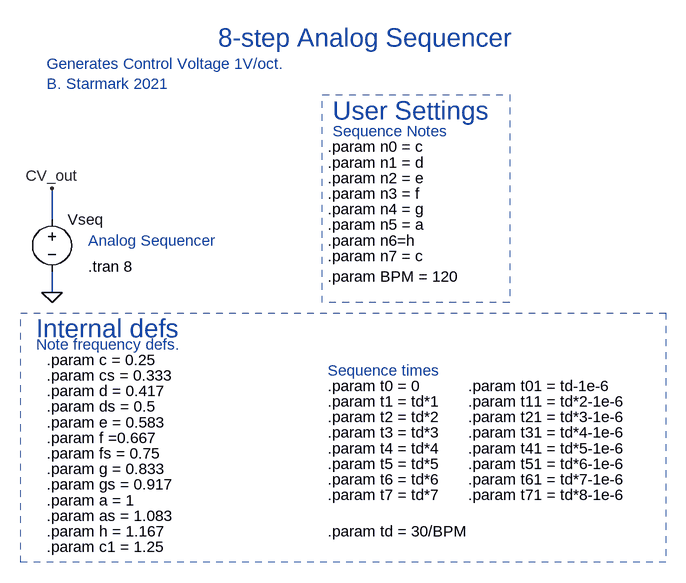
[diagram p0: schematic analog_sequencer_8.asc]
analog_sequencer_8.asc, the LTspice schematic file:
Version 4
SHEET 1 1448 1252
WIRE -576 0 -576 -48
WIRE -576 112 -576 80
FLAG -576 112 0
FLAG -576 -48 CV_out
SYMBOL voltage -576 -16 R0
WINDOW 3 28 110 Invisible 2
SYMATTR Value PWL REPEAT FOREVER ({t0} {n0} {t01} {n0} {t1} {n1} {t11} {n1} {t2} {n2} {t21} {n2} {t3} {n3} {t31} {n3} {t4} {n4} {t41} {n4} {t5} {n5} {t51} {n5} {t6} {n6} {t61} {n6} {t7} {n7} {t71} {n7}) ENDREPEAT
SYMATTR InstName Vseq
TEXT -520 72 Left 2 !.tran 8
TEXT -320 -280 Left 4 ;8-step Analog Sequencer
TEXT -584 -240 Left 2 ;Generates Control Voltage 1V/oct.\nB. Starmark 2021
TEXT -520 32 Left 2 ;Analog Sequencer
TEXT -152 -112 Left 2 !.param n0 = c
TEXT -152 -88 Left 2 !.param n1 = d
TEXT -152 -64 Left 2 !.param n2 = e
TEXT -152 -40 Left 2 !.param n3 = f
TEXT -152 -16 Left 2 !.param n4 = g
TEXT -152 8 Left 2 !.param n5 = a
TEXT -152 32 Left 2 !.param n6=h
TEXT -152 56 Left 2 !.param n7 = c
TEXT -600 192 Left 2 ;Note frequency defs.
TEXT -144 -136 Left 2 ;Sequence Notes
TEXT -152 88 Left 2 !.param BPM = 120
TEXT -152 232 Left 2 ;Sequence times
TEXT -152 256 Left 2 !.param t0 = 0
TEXT 64 256 Left 2 !.param t01 = td-1e-6
TEXT -152 480 Left 2 !.param td = 30/BPM
TEXT -152 280 Left 2 !.param t1 = td*1
TEXT 64 280 Left 2 !.param t11 = td*2-1e-6
TEXT -152 304 Left 2 !.param t2 = td*2
TEXT 64 304 Left 2 !.param t21 = td*3-1e-6
TEXT 64 328 Left 2 !.param t31 = td*4-1e-6
TEXT -152 328 Left 2 !.param t3 = td*3
TEXT -152 352 Left 2 !.param t4 = td*4
TEXT 64 352 Left 2 !.param t41 = td*5-1e-6
TEXT -152 376 Left 2 !.param t5 = td*5
TEXT 64 376 Left 2 !.param t51 = td*6-1e-6
TEXT 64 400 Left 2 !.param t61 = td*7-1e-6
TEXT -152 400 Left 2 !.param t6 = td*6
TEXT 64 424 Left 2 !.param t71 = td*8-1e-6
TEXT -152 424 Left 2 !.param t7 = td*7
TEXT -600 168 Left 4 ;Internal defs
TEXT -144 -168 Left 4 ;User Settings
TEXT -584 264 Left 2 !.param d = 0.417
TEXT -584 288 Left 2 !.param ds = 0.5
TEXT -584 312 Left 2 !.param e = 0.583
TEXT -584 336 Left 2 !.param f =0.667
TEXT -584 360 Left 2 !.param fs = 0.75
TEXT -584 384 Left 2 !.param g = 0.833
TEXT -584 408 Left 2 !.param gs = 0.917
TEXT -584 432 Left 2 !.param a = 1
TEXT -584 456 Left 2 !.param as = 1.083
TEXT -584 480 Left 2 !.param h = 1.167
TEXT -584 240 Left 2 !.param cs = 0.333
TEXT -584 216 Left 2 !.param c = 0.25
TEXT -584 504 Left 2 !.param c1 = 1.25
RECTANGLE Normal 368 528 -624 144 2
RECTANGLE Normal 128 128 -160 -192 2

The netlist it stands for:
* analog_sequencer_8.asc
Vseq CV_out 0 PWL REPEAT FOREVER ({t0} {n0} {t01} {n0} {t1} {n1} {t11} {n1} {t2} {n2} {t21} {n2} {t3} {n3} {t31} {n3} {t4} {n4} {t41} {n4} {t5} {n5} {t51} {n5} {t6} {n6} {t61} {n6} {t7} {n7} {t71} {n7}) ENDREPEAT
.tran 8
* 8-step Analog Sequencer
* Generates Control Voltage 1V/oct.
* B. Starmark 2021
* Analog Sequencer
.param n0 = c
.param n1 = d
.param n2 = e
.param n3 = f
.param n4 = g
.param n5 = a
.param n6=h
.param n7 = c
* Note frequency defs.
* Sequence Notes
.param BPM = 120
* Sequence times
.param t0 = 0
.param t01 = td-1e-6
.param td = 30/BPM
.param t1 = td*1
.param t11 = td*2-1e-6
.param t2 = td*2
.param t21 = td*3-1e-6
.param t31 = td*4-1e-6
.param t3 = td*3
.param t4 = td*4
.param t41 = td*5-1e-6
.param t5 = td*5
.param t51 = td*6-1e-6
.param t61 = td*7-1e-6
.param t6 = td*6
.param t71 = td*8-1e-6
.param t7 = td*7
* Internal defs
* User Settings
.param d = 0.417
.param ds = 0.5
.param e = 0.583
.param f =0.667
.param fs = 0.75
.param g = 0.833
.param gs = 0.917
.param a = 1
.param as = 1.083
.param h = 1.167
.param cs = 0.333
.param c = 0.25
.param c1 = 1.25
.backanno
.end